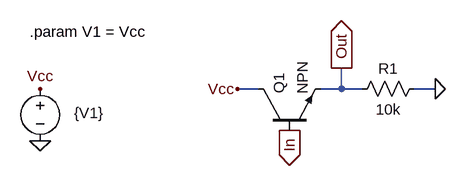
[diagram p0: schematic Buffer.asc]
Buffer.asc, the LTspice schematic file:
Version 4
SHEET 1 880 680
WIRE 48 112 16 112
WIRE 176 112 176 80
WIRE 176 112 144 112
WIRE 208 112 176 112
WIRE 320 112 288 112
FLAG 176 80 Out
IOPIN 176 80 Out
FLAG 96 176 In
IOPIN 96 176 Out
FLAG 320 112 0
FLAG -288 112 Vcc
FLAG 16 112 Vcc
FLAG -288 192 0
SYMBOL npn 48 176 R270
SYMATTR InstName Q1
SYMBOL res 304 96 R90
WINDOW 0 0 56 VBottom 2
WINDOW 3 32 56 VTop 2
SYMATTR InstName R1
SYMATTR Value 10k
SYMBOL voltage -288 96 R0
WINDOW 0 24 16 Invisible 2
WINDOW 3 52 53 Left 2
SYMATTR InstName V1
SYMATTR Value {V1}
TEXT -304 24 Left 2 !.param V1 = Vcc

The netlist it stands for:
* Buffer.asc
Q1 Vcc In Out 0 NPN
R1 0 Out 10k
V1 Vcc 0 {V1}
.model NPN NPN
.model PNP PNP
.lib standard.bjt
.param V1 = Vcc
.backanno
.end